# Altium schematic sheet Connectors.SchDoc
size B
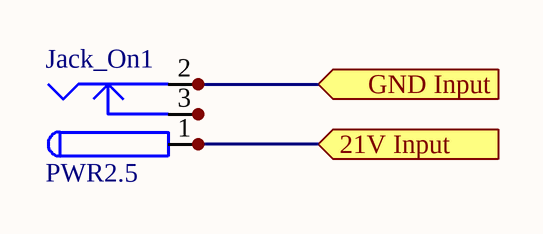
[diagram p0: Connectors.SchDoc]

## Parts
Jack_On1  PWR2.5  [KLD-0202]

## Ports
21V Input (in), GND Input (in)

## Nets
21V Input: Jack_On1.1 Jack_On1.1A Jack_On1.1B ; port 21V Input
GND Input: Jack_On1.2 Jack_On1.2A Jack_On1.2B ; port GND Input
NetJack_On1_3: Jack_On1.3 Jack_On1.3A Jack_On1.3B

## Notes on the sheet
- ESE
- is the sole property of ESE. Any reproduction
- The Information Contained in this drawing
- Schematic P/N and Name
- Sheet Name
- 299 Doon Valley Drive
- Kitchener, ON N2G 4M4
- Canada
- Approved
- in part or in whole without the written
- permission of ESE is strictly prohibited.
- APPROVALS
- DATE
- Size
- Scale
- B
- NTS
- Bare PCB P/N
- Date
- Sheet
- Rev.
- Checked
- Engineer
- of

## Library data of the parts
Jack_On1 = PWR2.5: Low Voltage Power Supply Connector; Published: 17-Dec-2003; DatasheetDocument: 09-May-2002; Publisher: Altium Limited; ComponentLink1Description: Manufacturer Link; ComponentLink1URL: http://domino.kycon.com/internet/Products.html